# Altium schematic sheet SoC_FPGA_67_68_69_DDR4.SchDoc: RFSoC AMC
size 420 x 297 mm; CompanyName: WUT; DrawnBy: T. Przywozki; Organization: WUT ISE; Address1: Warsaw University of Technology; Address2: Nowowiejska 15/19 00-665 Warsaw; Address3: Tomasz.Przywozki@pw.edu.pl; DocumentNumber: 4; Revision: 1; SheetNumber: 4; SheetTotal: 45; Project: RFSoC AMC; ModifiedBy: T. Przywozki; CreateDate: -; CheckedDate: -; DivGrp: ISE; Designer: T. Przywozki; ModifiedDate: -; ProjectName: ADC/DAC MEZZANINE
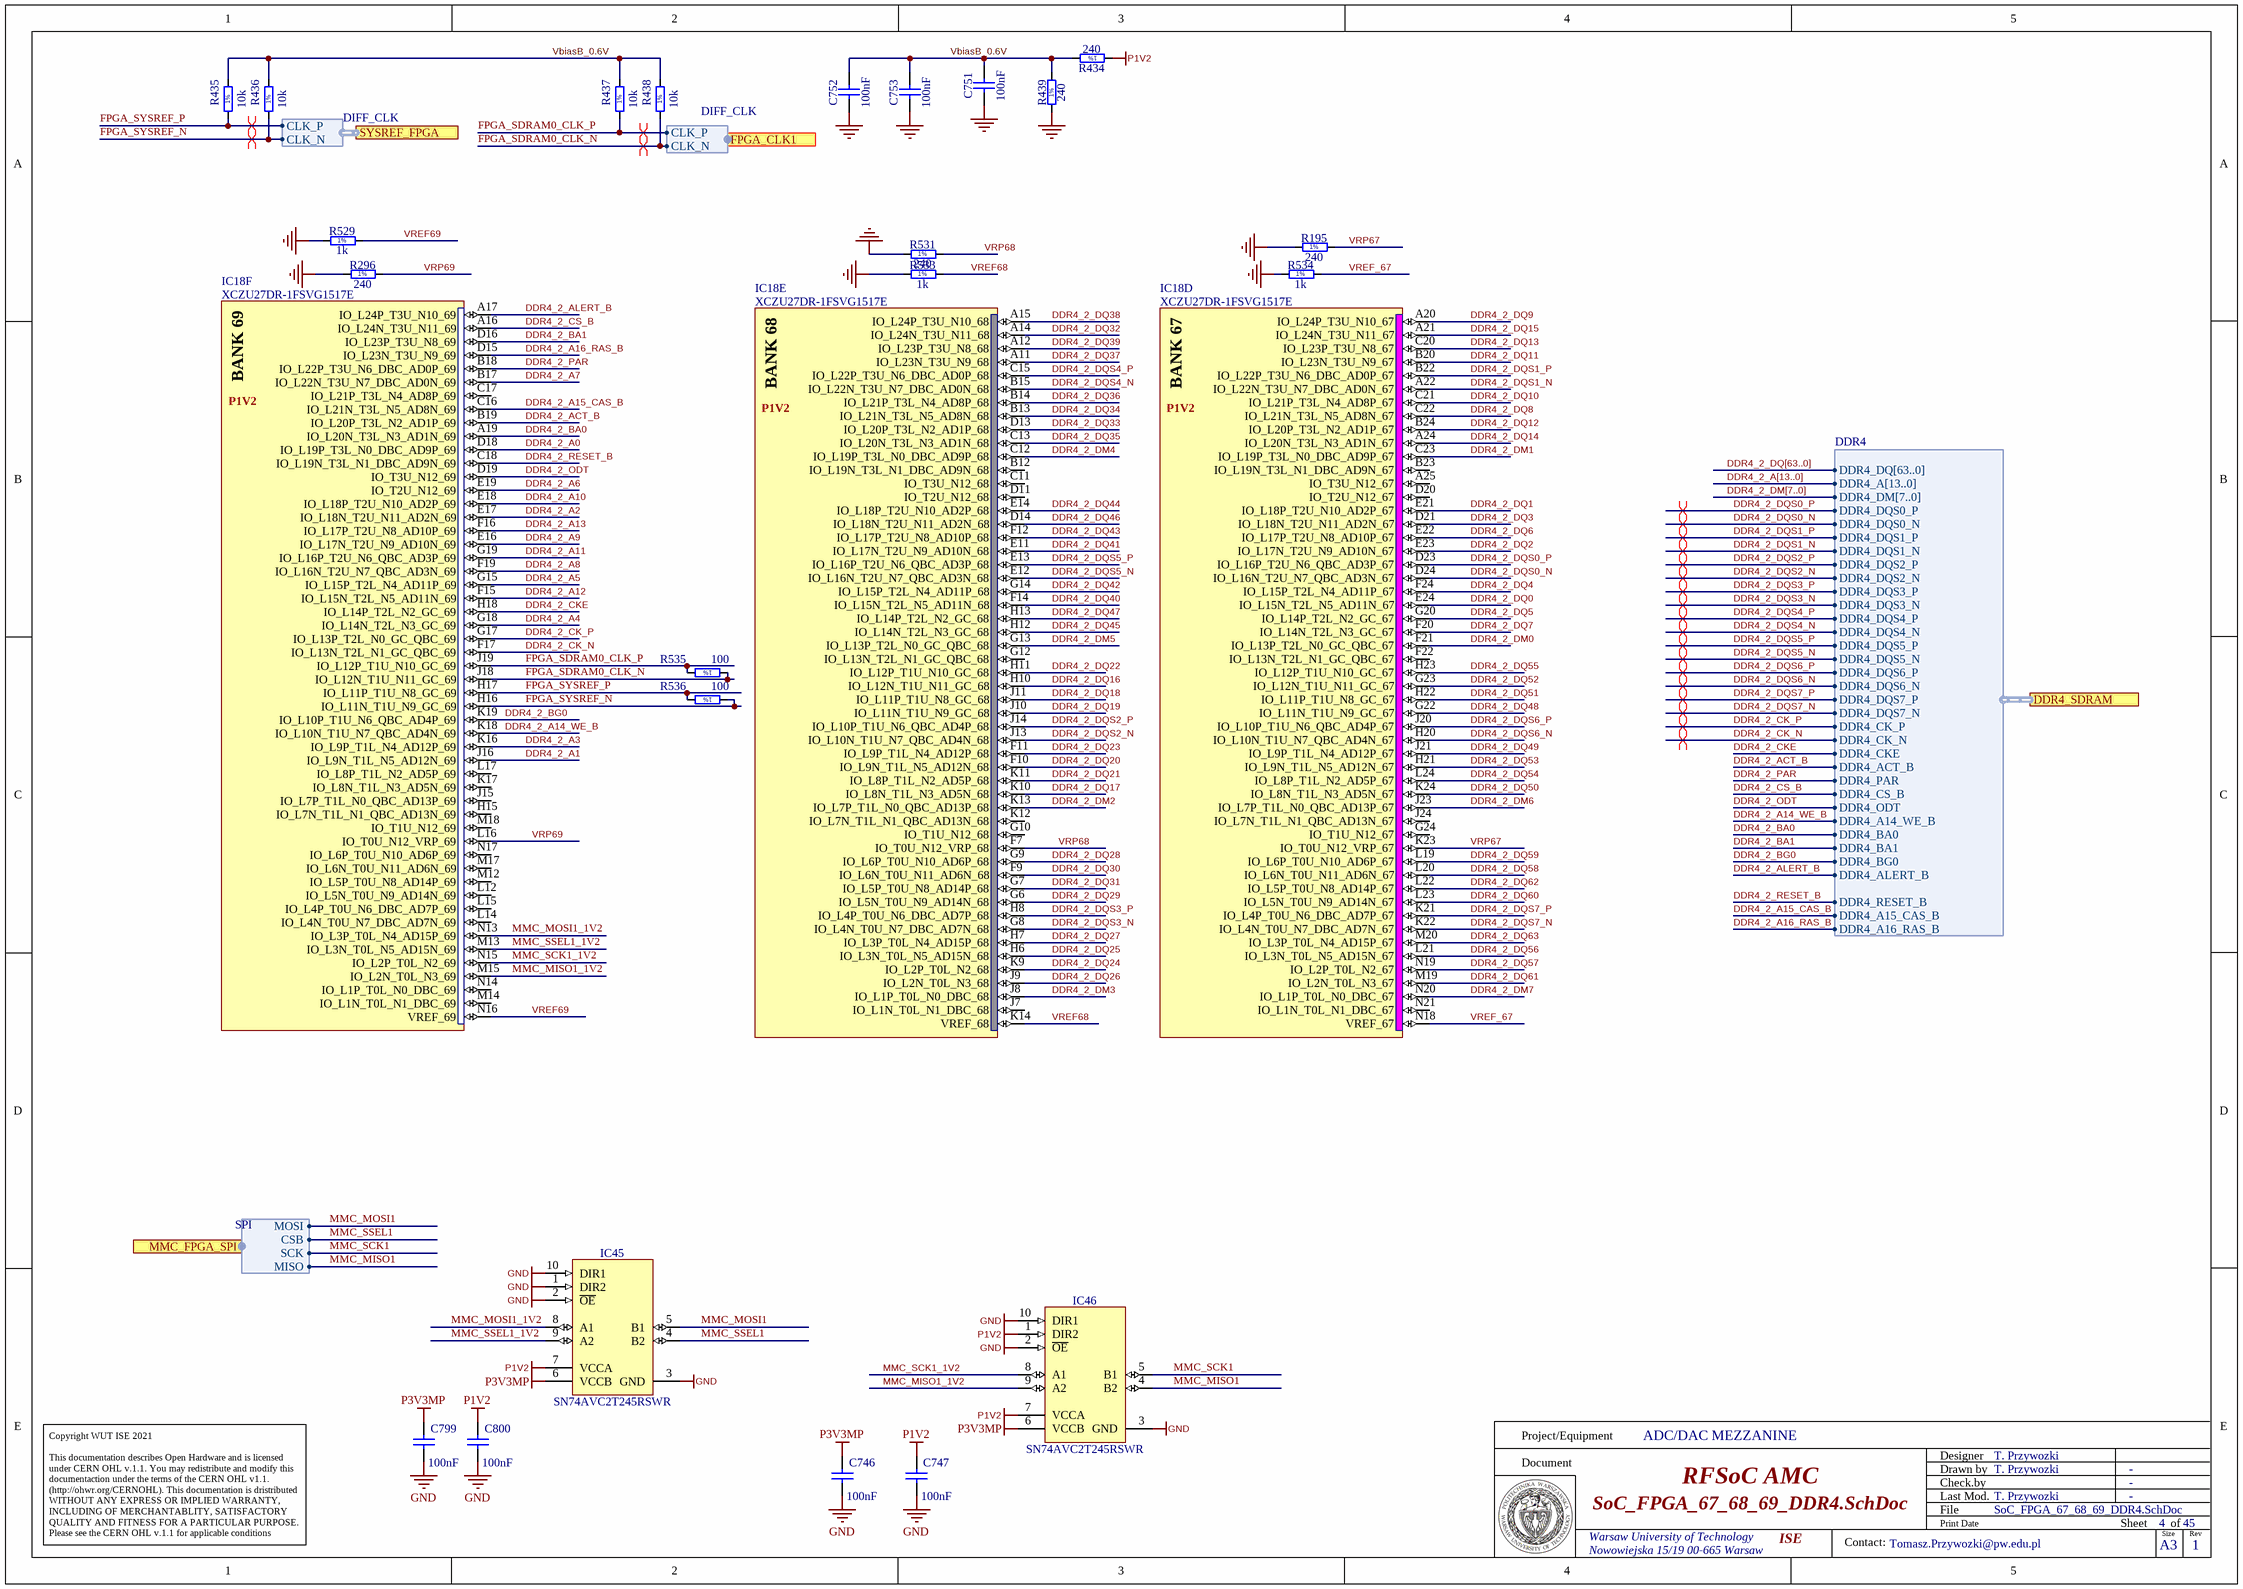
[diagram p0: SoC_FPGA_67_68_69_DDR4.SchDoc]

## Parts
C746  100nF  [CAPC0603X33N]
C747  100nF  [CAPC0603X33N]
C751  100nF  [CAPC0603X33N]
C752  100nF  [CAPC0603X33N]
C753  100nF  [CAPC0603X33N]
C799  100nF  [CAPC0603X33N]
C800  100nF  [CAPC0603X33N]
IC18  XCZU27DR-1FSVG1517E  [XILINX_FSVG1517 (XCZU27DR)]  (parts D,E,F of 31)
IC45  SN74AVC2T245RSWR  [QFN40P140X180X55-10N]
IC46  SN74AVC2T245RSWR  [QFN40P140X180X55-10N]
R195  240  [RESC1005X40N]
R296  240  [RESC1005X40N]
R434  240  [RESC1005X40N]
R435  10k  [RESC1005X40N]
R436  10k  [RESC1005X40N]
R437  10k  [RESC1005X40N]
R438  10k  [RESC1005X40N]
R439  240  [RESC1005X40N]
R529  1k  [RESC1005X40N]
R531  240  [RESC1005X40N]
R533  1k  [RESC1005X40N]
R534  1k  [RESC1005X40N]
R535  100  [RESC1005X40N]
R536  100  [RESC1005X40N]

## Ports
DDR4_SDRAM (harness DDR4), FPGA_CLK1 (out, harness DIFF_CLK), MMC_FPGA_SPI (harness SPI), SYSREF_FPGA (harness DIFF_CLK)

## Harnesses
DDR4: DDR4_DQ[63..0], DDR4_A[13..0], DDR4_DM[7..0], DDR4_DQS0_P, DDR4_DQS0_N, DDR4_DQS1_P, DDR4_DQS1_N, DDR4_DQS2_P, DDR4_DQS2_N, DDR4_DQS3_P, DDR4_DQS3_N, DDR4_DQS4_P, DDR4_DQS4_N, DDR4_DQS5_P, DDR4_DQS5_N, DDR4_DQS6_P, DDR4_DQS6_N, DDR4_DQS7_P, DDR4_DQS7_N, DDR4_CK_P, DDR4_CK_N, DDR4_CKE, DDR4_ACT_B, DDR4_PAR, DDR4_CS_B, DDR4_ODT, DDR4_A14_WE_B, DDR4_BA0, DDR4_BA1, DDR4_BG0, DDR4_ALERT_B, DDR4_RESET_B, DDR4_A15_CAS_B, DDR4_A16_RAS_B
DIFF_CLK: CLK_P, CLK_N
SPI: SCK, CSB, MISO, MOSI

## Nets
GND: C746.1 C747.1 C751.2 C752.2 C753.2 C799.1 C800.1 IC45.1(DIR2) IC45.2(~{OE}) IC45.3(GND) IC45.10(DIR1) IC46.2(~{OE}) IC46.3(GND) IC46.10(DIR1) R195.1 R296.1 R439.1 R529.1 R531.1 R533.1 R534.1
P1V2: C747.2 C800.2 IC45.7(VCCA) IC46.1(DIR2) IC46.7(VCCA) R434.1
P3V3MP: C746.2 C799.2 IC45.6(VCCB) IC46.6(VCCB)
DDR4_2_A0: IC18.D18(IO_L19P_T3L_N0_DBC_AD9P_69)
DDR4_2_A1: IC18.J16(IO_L9N_T1L_N5_AD12N_69)
DDR4_2_A2: IC18.E17(IO_L18N_T2U_N11_AD2N_69)
DDR4_2_A3: IC18.K16(IO_L9P_T1L_N4_AD12P_69)
DDR4_2_A4: IC18.G18(IO_L14N_T2L_N3_GC_69)
DDR4_2_A5: IC18.G15(IO_L15P_T2L_N4_AD11P_69)
DDR4_2_A6: IC18.E19(IO_T2U_N12_69)
DDR4_2_A7: IC18.B17(IO_L22N_T3U_N7_DBC_AD0N_69)
DDR4_2_A8: IC18.F19(IO_L16N_T2U_N7_QBC_AD3N_69)
DDR4_2_A9: IC18.E16(IO_L17N_T2U_N9_AD10N_69)
DDR4_2_A10: IC18.E18(IO_L18P_T2U_N10_AD2P_69)
DDR4_2_A11: IC18.G19(IO_L16P_T2U_N6_QBC_AD3P_69)
DDR4_2_A12: IC18.F15(IO_L15N_T2L_N5_AD11N_69)
DDR4_2_A13: IC18.F16(IO_L17P_T2U_N8_AD10P_69)
DDR4_2_A14_WE_B: IC18.K18(IO_L10N_T1U_N7_QBC_AD4N_69) ; port DDR4_SDRAM.DDR4_A14_WE_B
DDR4_2_A15_CAS_B: IC18.C16(IO_L21N_T3L_N5_AD8N_69) ; port DDR4_SDRAM.DDR4_A15_CAS_B
DDR4_2_A16_RAS_B: IC18.D15(IO_L23N_T3U_N9_69) ; port DDR4_SDRAM.DDR4_A16_RAS_B
DDR4_2_ACT_B: IC18.B19(IO_L20P_T3L_N2_AD1P_69) ; port DDR4_SDRAM.DDR4_ACT_B
DDR4_2_ALERT_B: IC18.A17(IO_L24P_T3U_N10_69) ; port DDR4_SDRAM.DDR4_ALERT_B
DDR4_2_BA0: IC18.A19(IO_L20N_T3L_N3_AD1N_69) ; port DDR4_SDRAM.DDR4_BA0
DDR4_2_BA1: IC18.D16(IO_L23P_T3U_N8_69) ; port DDR4_SDRAM.DDR4_BA1
DDR4_2_BG0: IC18.K19(IO_L10P_T1U_N6_QBC_AD4P_69) ; port DDR4_SDRAM.DDR4_BG0
DDR4_2_CK_N: IC18.F17(IO_L13N_T2L_N1_GC_QBC_69) ; port DDR4_SDRAM.DDR4_CK_N
DDR4_2_CK_P: IC18.G17(IO_L13P_T2L_N0_GC_QBC_69) ; port DDR4_SDRAM.DDR4_CK_P
DDR4_2_CKE: IC18.H18(IO_L14P_T2L_N2_GC_69) ; port DDR4_SDRAM.DDR4_CKE
DDR4_2_CS_B: IC18.A16(IO_L24N_T3U_N11_69) ; port DDR4_SDRAM.DDR4_CS_B
DDR4_2_DM0: IC18.F21(IO_L13P_T2L_N0_GC_QBC_67)
DDR4_2_DM1: IC18.C23(IO_L19P_T3L_N0_DBC_AD9P_67)
DDR4_2_DM2: IC18.K13(IO_L7P_T1L_N0_QBC_AD13P_68)
DDR4_2_DM3: IC18.J8(IO_L1P_T0L_N0_DBC_68)
DDR4_2_DM4: IC18.C12(IO_L19P_T3L_N0_DBC_AD9P_68)
DDR4_2_DM5: IC18.G13(IO_L13P_T2L_N0_GC_QBC_68)
DDR4_2_DM6: IC18.J23(IO_L7P_T1L_N0_QBC_AD13P_67)
DDR4_2_DM7: IC18.N20(IO_L1P_T0L_N0_DBC_67)
DDR4_2_DQ0: IC18.E24(IO_L15N_T2L_N5_AD11N_67)
DDR4_2_DQ1: IC18.E21(IO_L18P_T2U_N10_AD2P_67)
DDR4_2_DQ2: IC18.E23(IO_L17N_T2U_N9_AD10N_67)
DDR4_2_DQ3: IC18.D21(IO_L18N_T2U_N11_AD2N_67)
DDR4_2_DQ4: IC18.F24(IO_L15P_T2L_N4_AD11P_67)
DDR4_2_DQ5: IC18.G20(IO_L14P_T2L_N2_GC_67)
DDR4_2_DQ6: IC18.E22(IO_L17P_T2U_N8_AD10P_67)
DDR4_2_DQ7: IC18.F20(IO_L14N_T2L_N3_GC_67)
DDR4_2_DQ8: IC18.C22(IO_L21N_T3L_N5_AD8N_67)
DDR4_2_DQ9: IC18.A20(IO_L24P_T3U_N10_67)
DDR4_2_DQ10: IC18.C21(IO_L21P_T3L_N4_AD8P_67)
DDR4_2_DQ11: IC18.B20(IO_L23N_T3U_N9_67)
DDR4_2_DQ12: IC18.B24(IO_L20P_T3L_N2_AD1P_67)
DDR4_2_DQ13: IC18.C20(IO_L23P_T3U_N8_67)
DDR4_2_DQ14: IC18.A24(IO_L20N_T3L_N3_AD1N_67)
DDR4_2_DQ15: IC18.A21(IO_L24N_T3U_N11_67)
DDR4_2_DQ16: IC18.H10(IO_L12N_T1U_N11_GC_68)
DDR4_2_DQ17: IC18.K10(IO_L8N_T1L_N3_AD5N_68)
DDR4_2_DQ18: IC18.J11(IO_L11P_T1U_N8_GC_68)
DDR4_2_DQ19: IC18.J10(IO_L11N_T1U_N9_GC_68)
DDR4_2_DQ20: IC18.F10(IO_L9N_T1L_N5_AD12N_68)
DDR4_2_DQ21: IC18.K11(IO_L8P_T1L_N2_AD5P_68)
DDR4_2_DQ22: IC18.H11(IO_L12P_T1U_N10_GC_68)
DDR4_2_DQ23: IC18.F11(IO_L9P_T1L_N4_AD12P_68)
DDR4_2_DQ24: IC18.K9(IO_L2P_T0L_N2_68)
DDR4_2_DQ25: IC18.H6(IO_L3N_T0L_N5_AD15N_68)
DDR4_2_DQ26: IC18.J9(IO_L2N_T0L_N3_68)
DDR4_2_DQ27: IC18.H7(IO_L3P_T0L_N4_AD15P_68)
DDR4_2_DQ28: IC18.G9(IO_L6P_T0U_N10_AD6P_68)
DDR4_2_DQ29: IC18.G6(IO_L5N_T0U_N9_AD14N_68)
DDR4_2_DQ30: IC18.F9(IO_L6N_T0U_N11_AD6N_68)
DDR4_2_DQ31: IC18.G7(IO_L5P_T0U_N8_AD14P_68)
DDR4_2_DQ32: IC18.A14(IO_L24N_T3U_N11_68)
DDR4_2_DQ33: IC18.D13(IO_L20P_T3L_N2_AD1P_68)
DDR4_2_DQ34: IC18.B13(IO_L21N_T3L_N5_AD8N_68)
DDR4_2_DQ35: IC18.C13(IO_L20N_T3L_N3_AD1N_68)
DDR4_2_DQ36: IC18.B14(IO_L21P_T3L_N4_AD8P_68)
DDR4_2_DQ37: IC18.A11(IO_L23N_T3U_N9_68)
DDR4_2_DQ38: IC18.A15(IO_L24P_T3U_N10_68)
DDR4_2_DQ39: IC18.A12(IO_L23P_T3U_N8_68)
DDR4_2_DQ40: IC18.F14(IO_L15N_T2L_N5_AD11N_68)
DDR4_2_DQ41: IC18.E11(IO_L17N_T2U_N9_AD10N_68)
DDR4_2_DQ42: IC18.G14(IO_L15P_T2L_N4_AD11P_68)
DDR4_2_DQ43: IC18.F12(IO_L17P_T2U_N8_AD10P_68)
DDR4_2_DQ44: IC18.E14(IO_L18P_T2U_N10_AD2P_68)
DDR4_2_DQ45: IC18.H12(IO_L14N_T2L_N3_GC_68)
DDR4_2_DQ46: IC18.D14(IO_L18N_T2U_N11_AD2N_68)
DDR4_2_DQ47: IC18.H13(IO_L14P_T2L_N2_GC_68)
DDR4_2_DQ48: IC18.G22(IO_L11N_T1U_N9_GC_67)
DDR4_2_DQ49: IC18.J21(IO_L9P_T1L_N4_AD12P_67)
DDR4_2_DQ50: IC18.K24(IO_L8N_T1L_N3_AD5N_67)
DDR4_2_DQ51: IC18.H22(IO_L11P_T1U_N8_GC_67)
DDR4_2_DQ52: IC18.G23(IO_L12N_T1U_N11_GC_67)
DDR4_2_DQ53: IC18.H21(IO_L9N_T1L_N5_AD12N_67)
DDR4_2_DQ54: IC18.L24(IO_L8P_T1L_N2_AD5P_67)
DDR4_2_DQ55: IC18.H23(IO_L12P_T1U_N10_GC_67)
DDR4_2_DQ56: IC18.L21(IO_L3N_T0L_N5_AD15N_67)
DDR4_2_DQ57: IC18.N19(IO_L2P_T0L_N2_67)
DDR4_2_DQ58: IC18.L20(IO_L6N_T0U_N11_AD6N_67)
DDR4_2_DQ59: IC18.L19(IO_L6P_T0U_N10_AD6P_67)
DDR4_2_DQ60: IC18.L23(IO_L5N_T0U_N9_AD14N_67)
DDR4_2_DQ61: IC18.M19(IO_L2N_T0L_N3_67)
DDR4_2_DQ62: IC18.L22(IO_L5P_T0U_N8_AD14P_67)
DDR4_2_DQ63: IC18.M20(IO_L3P_T0L_N4_AD15P_67)
DDR4_2_DQS0_N: IC18.D24(IO_L16N_T2U_N7_QBC_AD3N_67) ; port DDR4_SDRAM.DDR4_DQS0_N
DDR4_2_DQS0_P: IC18.D23(IO_L16P_T2U_N6_QBC_AD3P_67) ; port DDR4_SDRAM.DDR4_DQS0_P
DDR4_2_DQS1_N: IC18.A22(IO_L22N_T3U_N7_DBC_AD0N_67) ; port DDR4_SDRAM.DDR4_DQS1_N
DDR4_2_DQS1_P: IC18.B22(IO_L22P_T3U_N6_DBC_AD0P_67) ; port DDR4_SDRAM.DDR4_DQS1_P
DDR4_2_DQS2_N: IC18.J13(IO_L10N_T1U_N7_QBC_AD4N_68) ; port DDR4_SDRAM.DDR4_DQS2_N
DDR4_2_DQS2_P: IC18.J14(IO_L10P_T1U_N6_QBC_AD4P_68) ; port DDR4_SDRAM.DDR4_DQS2_P
DDR4_2_DQS3_N: IC18.G8(IO_L4N_T0U_N7_DBC_AD7N_68) ; port DDR4_SDRAM.DDR4_DQS3_N
DDR4_2_DQS3_P: IC18.H8(IO_L4P_T0U_N6_DBC_AD7P_68) ; port DDR4_SDRAM.DDR4_DQS3_P
DDR4_2_DQS4_N: IC18.B15(IO_L22N_T3U_N7_DBC_AD0N_68) ; port DDR4_SDRAM.DDR4_DQS4_N
DDR4_2_DQS4_P: IC18.C15(IO_L22P_T3U_N6_DBC_AD0P_68) ; port DDR4_SDRAM.DDR4_DQS4_P
DDR4_2_DQS5_N: IC18.E12(IO_L16N_T2U_N7_QBC_AD3N_68) ; port DDR4_SDRAM.DDR4_DQS5_N
DDR4_2_DQS5_P: IC18.E13(IO_L16P_T2U_N6_QBC_AD3P_68) ; port DDR4_SDRAM.DDR4_DQS5_P
DDR4_2_DQS6_N: IC18.H20(IO_L10N_T1U_N7_QBC_AD4N_67) ; port DDR4_SDRAM.DDR4_DQS6_N
DDR4_2_DQS6_P: IC18.J20(IO_L10P_T1U_N6_QBC_AD4P_67) ; port DDR4_SDRAM.DDR4_DQS6_P
DDR4_2_DQS7_N: IC18.K22(IO_L4N_T0U_N7_DBC_AD7N_67) ; port DDR4_SDRAM.DDR4_DQS7_N
DDR4_2_DQS7_P: IC18.K21(IO_L4P_T0U_N6_DBC_AD7P_67) ; port DDR4_SDRAM.DDR4_DQS7_P
DDR4_2_ODT: IC18.D19(IO_T3U_N12_69) ; port DDR4_SDRAM.DDR4_ODT
DDR4_2_PAR: IC18.B18(IO_L22P_T3U_N6_DBC_AD0P_69) ; port DDR4_SDRAM.DDR4_PAR
DDR4_2_RESET_B: IC18.C18(IO_L19N_T3L_N1_DBC_AD9N_69) ; port DDR4_SDRAM.DDR4_RESET_B
FPGA_SDRAM0_CLK_N: IC18.J18(IO_L12N_T1U_N11_GC_69) R438.1 R535.2 ; port FPGA_CLK1.CLK_N
FPGA_SDRAM0_CLK_P: IC18.J19(IO_L12P_T1U_N10_GC_69) R437.1 R535.1 ; port FPGA_CLK1.CLK_P
FPGA_SYSREF_N: IC18.H16(IO_L11N_T1U_N9_GC_69) R436.1 R536.2 ; port SYSREF_FPGA.CLK_N
FPGA_SYSREF_P: IC18.H17(IO_L11P_T1U_N8_GC_69) R435.1 R536.1 ; port SYSREF_FPGA.CLK_P
MMC_MISO1: IC46.4(B2) ; port MMC_FPGA_SPI.MISO
MMC_MISO1_1V2: IC18.M15(IO_L2N_T0L_N3_69) IC46.9(A2)
MMC_MOSI1: IC45.5(B1) ; port MMC_FPGA_SPI.MOSI
MMC_MOSI1_1V2: IC18.N13(IO_L3P_T0L_N4_AD15P_69) IC45.8(A1)
MMC_SCK1: IC46.5(B1) ; port MMC_FPGA_SPI.SCK
MMC_SCK1_1V2: IC18.N15(IO_L2P_T0L_N2_69) IC46.8(A1)
MMC_SSEL1: IC45.4(B2) ; port MMC_FPGA_SPI.CSB
MMC_SSEL1_1V2: IC18.M13(IO_L3N_T0L_N5_AD15N_69) IC45.9(A2)
VbiasB_0.6V: C751.1 C752.1 C753.1 R434.2 R435.2 R436.2 R437.2 R438.2 R439.2
VREF68: IC18.K14(VREF_68) R533.2
VREF69: IC18.N16(VREF_69) R529.2
VREF_67: IC18.N18(VREF_67) R534.2
VRP67: IC18.K23(IO_T0U_N12_VRP_67) R195.2
VRP68: IC18.F7(IO_T0U_N12_VRP_68) R531.2
VRP69: IC18.L16(IO_T0U_N12_VRP_69) R296.2

Not connected (* = marked no-connect by the designer): IC18 A25(IO_T3U_N12_67) B12(IO_L19N_T3L_N1_DBC_AD9N_68) B23(IO_L19N_T3L_N1_DBC_AD9N_67) C11(IO_T3U_N12_68) C17(IO_L21P_T3L_N4_AD8P_69) D11(IO_T2U_N12_68) D20(IO_T2U_N12_67) F22(IO_L13N_T2L_N1_GC_QBC_67) G10(IO_T1U_N12_68) G12(IO_L13N_T2L_N1_GC_QBC_68) G24(IO_T1U_N12_67) H15(IO_L7N_T1L_N1_QBC_AD13N_69) J7(IO_L1N_T0L_N1_DBC_68) J15(IO_L7P_T1L_N0_QBC_AD13P_69) J24(IO_L7N_T1L_N1_QBC_AD13N_67) K12(IO_L7N_T1L_N1_QBC_AD13N_68) K17(IO_L8N_T1L_N3_AD5N_69) L12(IO_L5N_T0U_N9_AD14N_69) L14(IO_L4N_T0U_N7_DBC_AD7N_69) L15(IO_L4P_T0U_N6_DBC_AD7P_69) L17(IO_L8P_T1L_N2_AD5P_69) M12(IO_L5P_T0U_N8_AD14P_69) M14(IO_L1N_T0L_N1_DBC_69) M17(IO_L6N_T0U_N11_AD6N_69) M18(IO_T1U_N12_69) N14(IO_L1P_T0L_N0_DBC_69) N17(IO_L6P_T0U_N10_AD6P_69) N21(IO_L1N_T0L_N1_DBC_67)

## Buses and harness runs
bus DDR4_2_A[13..0]
bus DDR4_2_DM[7..0]
bus DDR4_2_DQ[63..0]

## Layout directives
differential pair: DDR4_2_CK_N, DDR4_2_CK_P, DDR4_2_DQS0_N, DDR4_2_DQS0_P, DDR4_2_DQS1_N, DDR4_2_DQS1_P, DDR4_2_DQS2_N, DDR4_2_DQS2_P, DDR4_2_DQS3_N, DDR4_2_DQS3_P, DDR4_2_DQS4_N, DDR4_2_DQS4_P, DDR4_2_DQS5_N, DDR4_2_DQS5_P, DDR4_2_DQS6_N, DDR4_2_DQS6_P, DDR4_2_DQS7_N, DDR4_2_DQS7_P, FPGA_SDRAM0_CLK_N, FPGA_SDRAM0_CLK_P, FPGA_SYSREF_N, FPGA_SYSREF_P

## Notes on the sheet
- P1V2
- Project/Equipment
- Document
- Designer
- Drawn by
- Check.by
- Copyright WUT ISE 2021
  This documentation describes Open Hardware and is licensed under CERN OHL v.1.1. You may redistribute and modify this documentaction under the terms of the CERN OHL v1.1.
  (http://ohwr.org/CERNOHL). This documentation is dristributed WITHOUT ANY EXPRESS OR IMPLIED WARRANTY, INCLUDING OF MERCHANTABLITY, SATISFACTORY QUALITY AND FITNESS FOR A PARTICULAR PURPOSE. Please see the CERN OHL v.1.1 for applicable conditions
- File
- Last Mod.
- Print Date
- Sheet
- Size
- A3
- of
- Rev
- Contact:
- (in symbol R0402_1K_1%_0.0625W_100PPM) 1%
- (in symbol R0402_10K_1%_0.0625W_100PPM) 1%
- (in symbol R0402_100R_1%_0.0625W_100PPM) 1%
- (in symbol R0402_240R_1%_0.0625W_100PPM) 1%
- (in symbol XCZU27DR-1FSVG1517E, part D) BANK 67
- (in symbol XCZU27DR-1FSVG1517E, part E) BANK 68
- (in symbol XCZU27DR-1FSVG1517E, part F) BANK 69

## Library data of the parts
C746 C747 C799 C800 = CC0201_100NF_6.3V_10%_X5R: Non-polarised capacitor; Manufacturer: GENERIC; Manufacturer1 Part Number: 02016D104KAT2A; Part Description: SMD Multilayer Chip Ceramic Capacitor; TC: X5R; Tolerance: ±10%; Voltage: 6.3V; Case: 0201; Manufacturer Part Number: CC0201_100NF_6.3V_10%_X5R; Manufacturer1 Example: AVX; Part Number: CC0201_100NF_6.3V_10%_X5R; Pin Count: 2; SMD: Yes; Status: Not Recommended; Value: 100nF; Component Kind: Standard; Component Type: Standard; Mounted: Yes; Socket: No; Sense: No; Manufacturer1 ComponentHeight: 0.33mm; HelpURL: \\cern.ch\dfs\Applications\Altium\Datasheets\CC0201_X5R_AVX.pdf; Author: CERN DEM JLC; CreateDate: 03.12.2007; LatestRevisionDate: 03.12.2007
C751-C753 = CC0201_100NF_6.3V_10%_X5R: Non-polarised capacitor; Manufacturer: GENERIC; Part Description: SMD Multilayer Chip Ceramic Capacitor; Manufacturer1 Part Number: 02016D104KAT2A; Tolerance: ±10%; Voltage: 6.3V; TC: X5R; Manufacturer Part Number: CC0201_100NF_6.3V_10%_X5R; Part Number: CC0201_100NF_6.3V_10%_X5R; Value: 100nF; Component Kind: Standard; Component Type: Standard; Pin Count: 2; Status: Not Recommended; Case: 0201; Mounted: Yes; Socket: No; SMD: Yes; Sense: No; Manufacturer1 Example: AVX; Manufacturer1 ComponentHeight: 0.33mm; HelpURL: \\cern.ch\dfs\Applications\Altium\Datasheets\CC0201_X5R_AVX.pdf; Author: CERN DEM JLC; CreateDate: 03.12.2007; LatestRevisionDate: 03.12.2007
IC18 = XCZU27DR-1FSVG1517E: Zynq UltraScale+ RFSoC, Quad-Core ARM® Cortex™-A53 MPCore™ up to 1.5GHz, 214 PS I/O, 299 HP I/O, 48 HD I/O, 1517-Pin BGA; Manufacturer: XILINX; PressFit: No; Bonding: No; Part Number: XCZU27DR-1FSVG1517E; Component Kind: Standard; Component Type: Standard; Device: XCZU27DR-1FSVG1517E; PackageDescription: BGA, 1.00mm Pitch, Square; 1517 Pin, 39 Columns X 39 Rows, 40.00mm X 40.00mm X 4.01mm H; Part Description: Zynq UltraScale+ RFSoC, Quad-Core ARM® Cortex™-A53 MPCore™ up to 1.5GHz, 214 PS I/O, 299 HP I/O, 48 HD I/O, 1517-Pin BGA; Manufacturer Part Number: XCZU27DR-1FSVG1517E; Pin Count: 1517; Case: BGA1517; Mounted: Yes; Socket: No; SMD: Yes; Sense: No; ComponentHeight: 4.01mm; HelpURL: \\cern.ch\dfs\Applications\Altium\Datasheets\XCZU27DR-1FSVG1517E.pdf; ComponentLink1URL: \\cern.ch\dfs\Applications\Altium\Datasheets\XCZU27DR-1FSVG1517E_Package-Pinout.pdf; ComponentLink1Description: Package/Pinout; ComponentLink2URL: \\cern.ch\dfs\Applications\Altium\Datasheets\XCZU27DR-1FSVG1517E_Pinout.pdf; ComponentLink2Description: Pinout; Author: CERN DEM MR; CreateDate: 02/05/2018; LatestRevisionDate: 02/05/2018
IC45 IC46 = SN74AVC2T245RSWR: Dual-Bit Dual-Supply Bus Transceiver With Configurable Voltage Translation and 3-State Outputs; Manufacturer: TEXAS INSTRUMENTS; PressFit: No; Bonding: No; Manufacturer Part Number: SN74AVC2T245RSWR; PackageDescription: QFN, 0.40mm Pitch, Rect.;10 Pin, 1.80mm L X 1.40mm W X 0.55mm H Body, IPC Medium Density; Part Description: Dual-Bit Dual-Supply Bus Transceiver With Configurable Voltage Translation and 3-State Outputs; Part Number: SN74AVC2T245RSWR; Component Kind: Standard; Component Type: Standard; Device: SN74AVC2T245RSWR; Status: Not Recommended; Pin Count: 10; Case: QFN10; Mounted: Yes; Socket: No; SMD: Yes; Sense: No; ComponentHeight: 0.55mm; Author: CERN DEM JLC; HelpURL: \\cern.ch\dfs\Applications\Altium\Datasheets\SN74AVC2T245RSWR.pdf; CreateDate: 07.07.2014; LatestRevisionDate: 30.03.2017
R195 R296 R434 R439 R531 = R0402_240R_1%_0.0625W_100PPM: Resistor - 1%; Manufacturer: GENERIC; Part Description: General Purpose Thick Film Chip Resistor; Manufacturer1 Part Number: 232270672401L; TC: ±100ppm/°C; PressFit: No; Manufacturer Part Number: R0402_240R_1%_0.0625W_100PPM; Part Number: R0402_240R_1%_0.0625W_100PPM; Tolerance: ±1%; Value: 240; Component Kind: Standard; Component Type: Standard; Pin Count: 2; Status: Not Recommended; Power: 0.0625W; Case: 0402; Mounted: Yes; Sense: No; Socket: No; SMD: Yes; Manufacturer1 Example: YAGEO PHYCOMP; Manufacturer1 ComponentHeight: 0.4mm; HelpURL: \\cern.ch\dfs\Applications\Altium\Datasheets\R0402_Phycomp_RC0402.pdf; Author: CERN DEM JLC; CreateDate: 03.12.2007; LatestRevisionDate: 17.10.2012
R435-R438 = R0402_10K_1%_0.0625W_100PPM: Resistor - 1%; Manufacturer: GENERIC; Part Description: General Purpose Thick Film Chip Resistor; Manufacturer1 Part Number: 232270671003L; TC: ±100ppm/°C; PressFit: No; Manufacturer Part Number: R0402_10K_1%_0.0625W_100PPM; Part Number: R0402_10K_1%_0.0625W_100PPM; Tolerance: ±1%; Value: 10k; Component Kind: Standard; Component Type: Standard; Pin Count: 2; Status: Not Recommended; Power: 0.0625W; Case: 0402; Mounted: Yes; Sense: No; Socket: No; SMD: Yes; Manufacturer1 Example: YAGEO PHYCOMP; Manufacturer1 ComponentHeight: 0.4mm; HelpURL: \\cern.ch\dfs\Applications\Altium\Datasheets\R0402_Phycomp_RC0402.pdf; Author: CERN DEM JLC; CreateDate: 03.12.2007; LatestRevisionDate: 17.10.2012
R529 R533 R534 = R0402_1K_1%_0.0625W_100PPM: Resistor - 1%; Manufacturer: GENERIC; Part Description: General Purpose Thick Film Chip Resistor; Manufacturer1 Part Number: 232270671002L; TC: ±100ppm/°C; PressFit: No; Manufacturer Part Number: R0402_1K_1%_0.0625W_100PPM; Part Number: R0402_1K_1%_0.0625W_100PPM; Tolerance: ±1%; Value: 1k; Component Kind: Standard; Component Type: Standard; Pin Count: 2; Status: Not Recommended; Power: 0.0625W; Case: 0402; Mounted: Yes; Sense: No; Socket: No; SMD: Yes; Manufacturer1 Example: YAGEO PHYCOMP; Manufacturer1 ComponentHeight: 0.4mm; HelpURL: \\cern.ch\dfs\Applications\Altium\Datasheets\R0402_Phycomp_RC0402.pdf; Author: CERN DEM JLC; CreateDate: 03.12.2007; LatestRevisionDate: 17.10.2012
R535 R536 = R0402_100R_1%_0.0625W_100PPM: Resistor - 1%; Manufacturer: GENERIC; Part Description: General Purpose Thick Film Chip Resistor; Manufacturer1 Part Number: 232270671001L; TC: ±100ppm/°C; PressFit: No; Manufacturer Part Number: R0402_100R_1%_0.0625W_100PPM; Part Number: R0402_100R_1%_0.0625W_100PPM; Tolerance: ±1%; Value: 100; Component Kind: Standard; Component Type: Standard; Pin Count: 2; Status: Not Recommended; Power: 0.0625W; Case: 0402; Mounted: Yes; Sense: No; Socket: No; SMD: Yes; Manufacturer1 Example: YAGEO PHYCOMP; Manufacturer1 ComponentHeight: 0.4mm; HelpURL: \\cern.ch\dfs\Applications\Altium\Datasheets\R0402_Phycomp_RC0402.pdf; Author: CERN DEM JLC; CreateDate: 03/12/2007; LatestRevisionDate: 17/10/2012